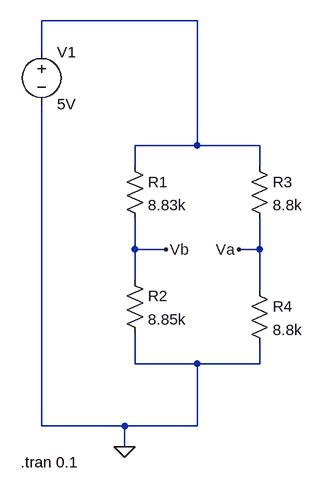
[diagram p0: schematic 6410_project_sim.asc]
6410_project_sim.asc, the LTspice schematic file:
Version 4.1
SHEET 1 880 680
WIRE 192 -128 -48 -128
WIRE -48 -80 -48 -128
WIRE 192 64 192 -128
WIRE 192 64 96 64
WIRE 288 64 192 64
WIRE 96 96 96 64
WIRE 288 96 288 64
WIRE 96 224 96 176
WIRE 144 224 96 224
WIRE 288 224 288 176
WIRE 288 224 256 224
WIRE 96 272 96 224
WIRE 288 288 288 224
WIRE 96 400 96 352
WIRE 192 400 96 400
WIRE 288 400 288 368
WIRE 288 400 192 400
WIRE -48 496 -48 0
WIRE 80 496 -48 496
WIRE 192 496 192 400
WIRE 192 496 80 496
WIRE 80 528 80 496
FLAG 80 528 0
FLAG 144 224 Vb
FLAG 256 224 Va
SYMBOL res 80 80 R0
SYMATTR InstName R1
SYMATTR Value 8.83k
SYMBOL res 80 256 R0
SYMATTR InstName R2
SYMATTR Value 8.85k
SYMBOL res 272 80 R0
SYMATTR InstName R3
SYMATTR Value 8.8k
SYMBOL res 272 272 R0
SYMATTR InstName R4
SYMATTR Value 8.8k
SYMBOL voltage -48 -96 R0
SYMATTR InstName V1
SYMATTR Value 5V
TEXT -80 552 Left 2 !.tran 0.1

The netlist it stands for:
* 6410_project_sim.asc
R1 N001 Vb 8.83k
R2 Vb 0 8.85k
R3 N001 Va 8.8k
R4 Va 0 8.8k
V1 N001 0 5V
.tran 0.1
.backanno
.end